# Altium schematic sheet FPGA_Memec_CPLD95XL_Demo_Board.SchDoc: Example for Memec 95XL Demo Board
size B; DocumentNumber: 1; SheetNumber: 1; SheetTotal: 1; Address1: L3, 12a Rodborough Rd; Address2: Frenchs Forest; Address3: NSW; Address4: Australia 2086; Organization: Altium Limited
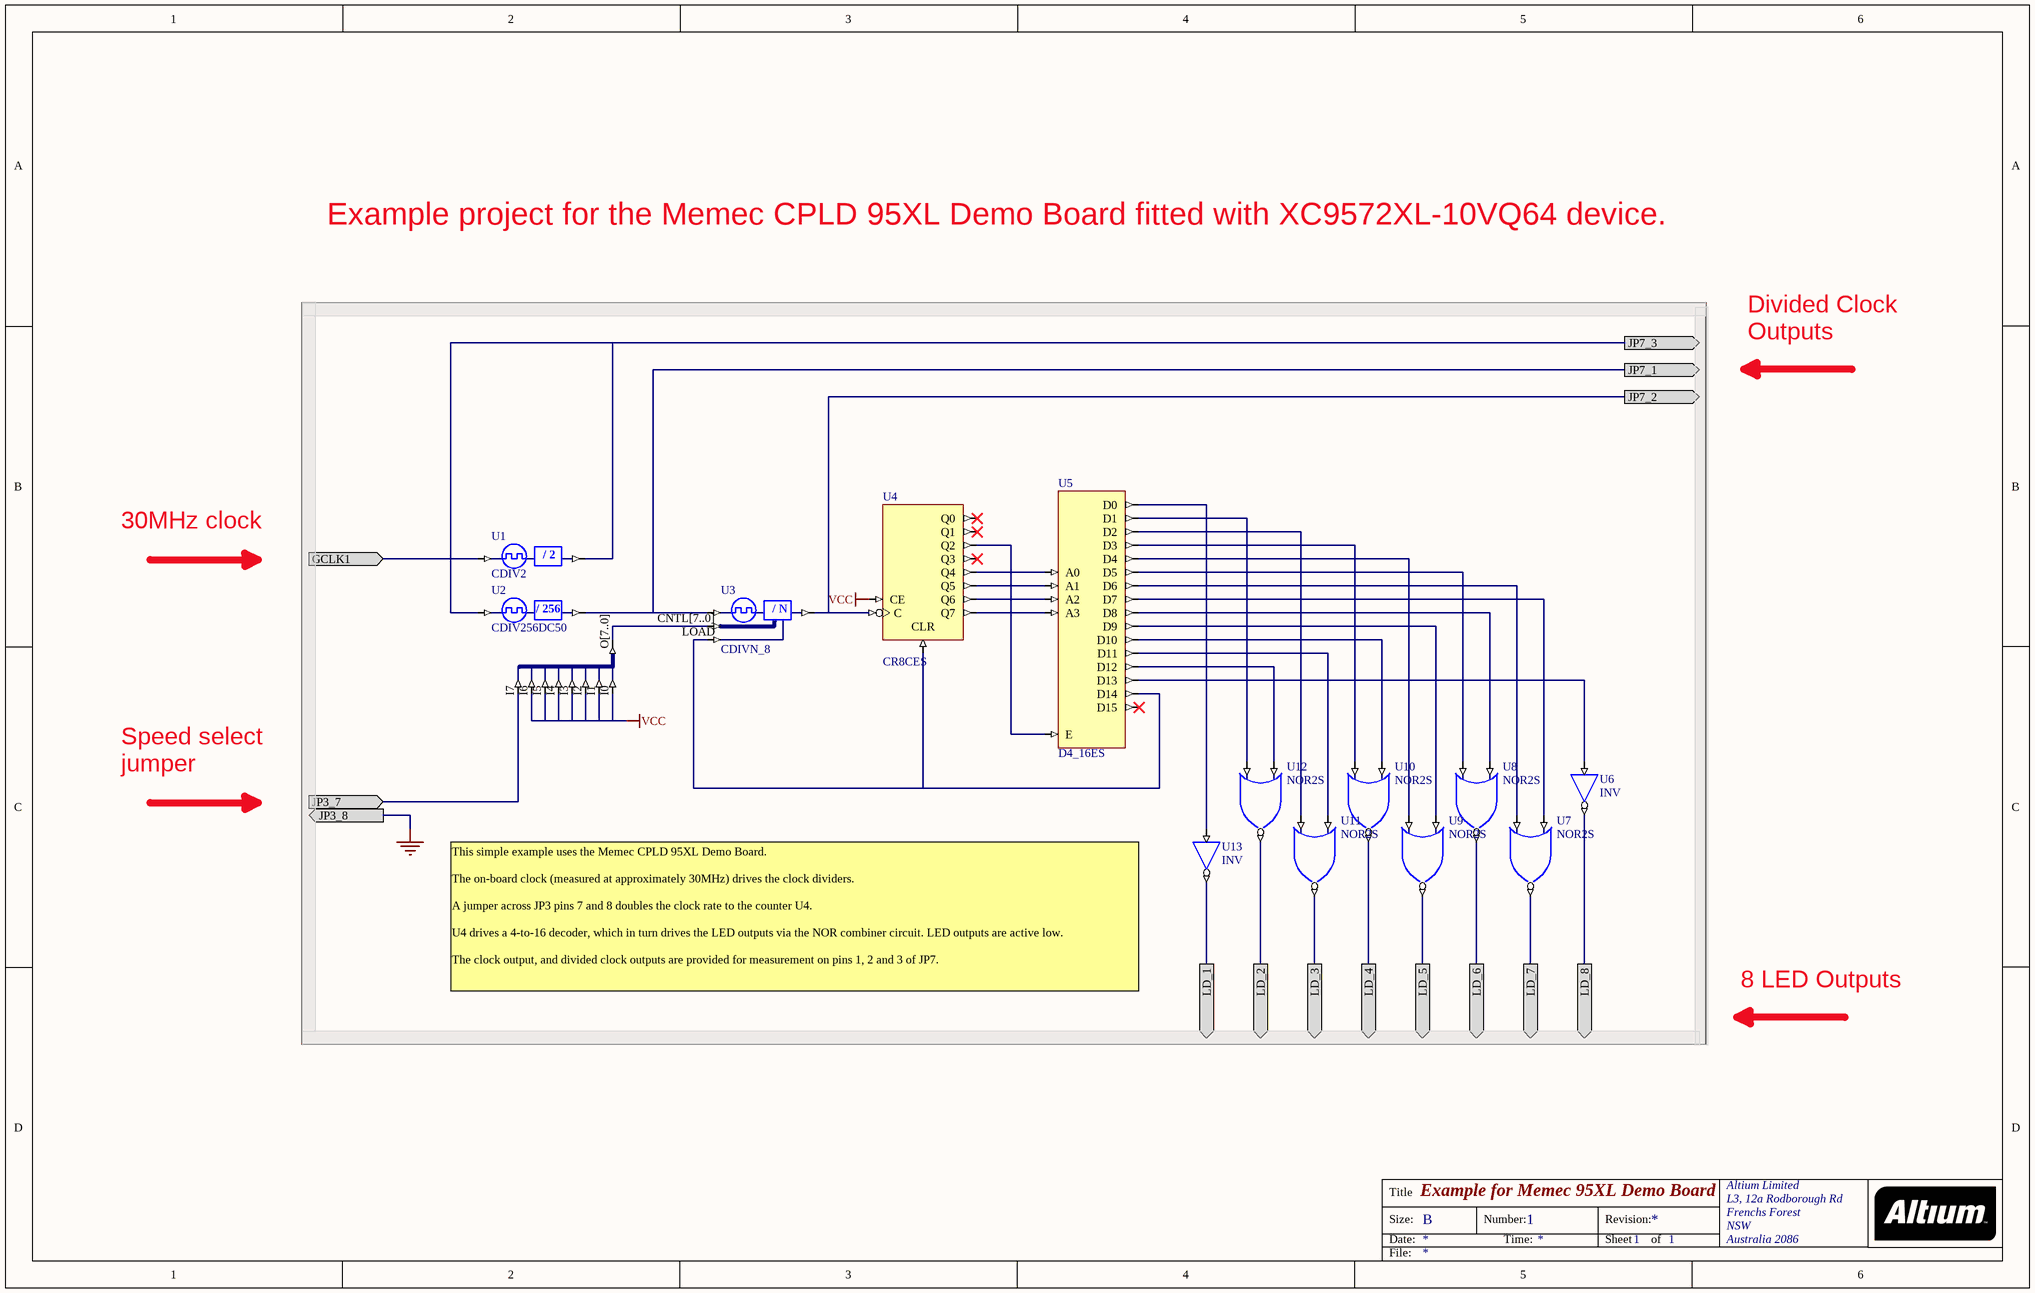
[diagram p0: FPGA_Memec_CPLD95XL_Demo_Board.SchDoc]

## Parts
U1  CDIV2
U2  CDIV256DC50
U3  CDIVN_8
U4  CR8CES
U5  D4_16ES
U6  INV
U7  NOR2S
U8  NOR2S
U9  NOR2S
U10  NOR2S
U11  NOR2S
U12  NOR2S
U13  INV
U14  J8S_8B  (value not drawn)

## Ports
GCLK1 (in), JP3_7 (in), JP3_8 (out), JP7_1 (out), JP7_2 (out), JP7_3 (out), LD_1 (out), LD_2 (out), LD_3 (out), LD_4 (out), LD_5 (out), LD_6 (out), LD_7 (out), LD_8 (out)

## Nets
GND: port JP3_8
VCC: U4.CE U14.I0 U14.I1 U14.I2 U14.I3 U14.I4 U14.I5 U14.I6
GCLK1: U1.CLKIN ; port GCLK1
JP3_7: U14.I7 ; port JP3_7
JP7_1: U2.CLKDV U3.CLKIN ; port JP7_1
JP7_2: U3.CLKDV U4.C ; port JP7_2
JP7_3: U1.CLKDV U2.CLKIN ; port JP7_3
LD_1: U13.O ; port LD_1
LD_2: U12.O ; port LD_2
LD_3: U11.O ; port LD_3
LD_4: U10.O ; port LD_4
LD_5: U9.O ; port LD_5
LD_6: U8.O ; port LD_6
LD_7: U7.O ; port LD_7
LD_8: U6.O ; port LD_8
NetU3_CNTL[7..0]: U3.CNTL[7..0] U14.O[7..0]
NetU3_LOAD: U3.LOAD U4.CLR U5.D14
NetU4_Q2: U4.Q2 U5.E
NetU4_Q4: U4.Q4 U5.A0
NetU4_Q5: U4.Q5 U5.A1
NetU4_Q6: U4.Q6 U5.A2
NetU4_Q7: U4.Q7 U5.A3
NetU5_D0: U5.D0 U13.I
NetU5_D1: U5.D1 U12.I1
NetU5_D2: U5.D2 U11.I1
NetU5_D3: U5.D3 U10.I1
NetU5_D4: U5.D4 U9.I1
NetU5_D5: U5.D5 U8.I1
NetU5_D6: U5.D6 U7.I1
NetU5_D7: U5.D7 U7.I0
NetU5_D8: U5.D8 U8.I0
NetU5_D9: U5.D9 U9.I0
NetU5_D10: U5.D10 U10.I0
NetU5_D11: U5.D11 U11.I0
NetU5_D12: U5.D12 U12.I0
NetU5_D13: U5.D13 U6.I

Not connected (* = marked no-connect by the designer): U4 Q0* Q1* Q3*; U5 D15*

## Notes on the sheet
- Example project for the Memec CPLD 95XL Demo Board fitted with XC9572XL-10VQ64 device.
- Divided Clock Outputs
- 30MHz clock
- Speed select jumper
- This simple example uses the Memec CPLD 95XL Demo Board.
  The on-board clock (measured at approximately 30MHz) drives the clock dividers.
  A jumper across JP3 pins 7 and 8 doubles the clock rate to the counter U4.
  U4 drives a 4-to-16 decoder, which in turn drives the LED outputs via the NOR combiner circuit. LED outputs are active low.
  The clock output, and divided clock outputs are provided for measurement on pins 1, 2 and 3 of JP7.
- 8 LED Outputs
- Title
- Size:
- Date:
- B
- Number:
- Time:
- Revision:
- Sheet
- of
- File:
- (in symbol CDIV2) / 2
- (in symbol CDIV256DC50) / 256
- (in symbol CDIVN_8) / N

## Library data of the parts
U1 = CDIV2: Clock Divider by 2; DivisorRate: 2; ArchiveName: GENERIC; VHDLIB_SIM: GENERIC_LIB; Published: 29-Jan-2004; Publisher: Altium Limited; LastRevisionNo: 1.00.00; HelpURL: CR0118 FPGA Generic Library Guide.pdf#page=141; FunctionalClass: Clock Divider
U2 = CDIV256DC50: Clock Divider by 256 with 50% Duty Cycle Output; DivisorRate: 256; DutyCycle: 50; ArchiveName: GENERIC; VHDLIB_SIM: GENERIC_LIB; Published: 29-Jan-2004; Publisher: Altium Limited; LastRevisionNo: 1.00.00; HelpURL: CR0118 FPGA Generic Library Guide.pdf#page=142; FunctionalClass: Clock Divider
U3 = CDIVN_8: 8-Bit Programmable Clock Divider; PortSize: 8; ArchiveName: GENERIC; VHDLIB_SIM: GENERIC_LIB; Published: 29-Jan-2004; Publisher: Altium Limited; LastRevisionNo: 1.00.00; HelpURL: CR0118 FPGA Generic Library Guide.pdf#page=143; FunctionalClass: Clock Divider; DivisorRate: Programmable
U4 = CR8CES: 8-Bit Negative-Edge Binary Ripple Counters with Clock Enable and Asynchronous Clear, Single Pin Version; ClockTrigger: Falling; Enable: High; PortSize: 8; ArchiveName: GENERIC; VHDLIB_SIM: GENERIC_LIB; Published: 29-Jan-2004; Publisher: Altium Limited; LastRevisionNo: 1.00.00; HelpURL: CR0118 FPGA Generic Library Guide.pdf#page=155; FunctionalClass: Counter; SubClass: Ripple; Reset: Asynchronous; PortType: Single Pin Version
U5 = D4_16ES: Binary 4- to 16-Bit Decoder with Enable, Single Pin Version; XilinxEquivalent: D4_16E; SubClass: n_m; Enable: High; PortSize: 16; ArchiveName: GENERIC; VHDLIB_SIM: GENERIC_LIB; Published: 29-Jan-2004; Publisher: Altium Limited; LastRevisionNo: 1.00.00; HelpURL: CR0118 FPGA Generic Library Guide.pdf#page=158; FunctionalClass: Decoder; PortStyle: Single Pin Version
U6 U13 = INV: Inverter; FunctionalClass: Logic Primitive; ArchiveName: GENERIC; VHDLIB_SIM: GENERIC_LIB; Published: 29-Jan-2004; Publisher: Altium Limited; XilinxEquivalent: INV; LastRevisionNo: 1.00.00; HelpURL: CR0118 FPGA Generic Library Guide.pdf#page=290; SubClass: INV
U7-U12 = NOR2S: 2-Input NOR Gate, Single Pin Version; XilinxEquivalent: NOR2; FunctionalClass: Logic Primitive; PortSize: 2; ArchiveName: GENERIC; VHDLIB_SIM: GENERIC_LIB; Published: 29-Jan-2004; Publisher: Altium Limited; LastRevisionNo: 1.00.00; HelpURL: CR0118 FPGA Generic Library Guide.pdf#page=400; SubClass: NOR; PortStyle: Single Pin Version
U14 = J8S_8B: 8 Single pin inputs to single 8-Bit output bus; FunctionalClass: Bus Joiner; PortSize: 8; ArchiveName: GENERIC; VHDLIB_SIM: GENERIC_LIB; Published: 29-Jan-2004; Publisher: Altium Limited; LastRevisionNo: 1.00.00; HelpURL: CR0118 FPGA Generic Library Guide.pdf#page=305